# EAGLE design combo_board (EAGLE 9.5.2)
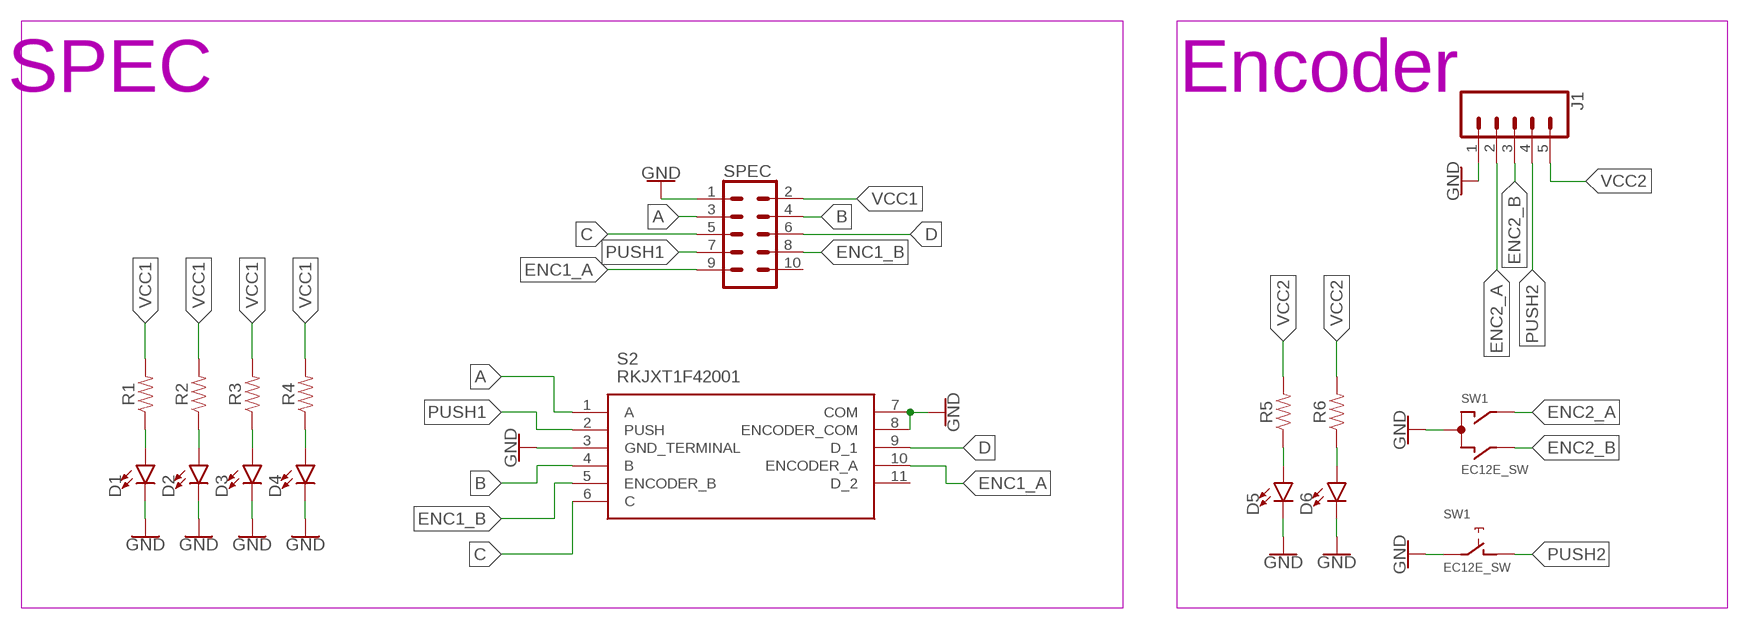
[diagram p0: schematic, sheet 1]

## Parts
D1  LED-3MM-NO_SILK  [LED_3MM-NS]
D2  LED-3MM-NO_SILK  [LED_3MM-NS]
D3  LED-3MM-NO_SILK  [LED_3MM-NS]
D4  LED-3MM-NO_SILK  [LED_3MM-NS]
D5  LED-3MM-NO_SILK  [LED_3MM-NS]
D6  LED-3MM-NO_SILK  [LED_3MM-NS]
J1  CONN_05  [1X05]
R1  RESISTOR1206  [1206]
R2  RESISTOR1206  [1206]
R3  RESISTOR1206  [1206]
R4  RESISTOR1206  [1206]
R5  RESISTOR1206  [1206]
R6  RESISTOR1206  [1206]
S2  RKJXT1F42001  [RKJXT1F42001]
SPEC  CONN_05X2PTH  [2X5]
SW1  EC12E_SW  [ALPS_EC12E_SW]

## Nets
A: S2.1(A) SPEC.3
B: S2.4(B) SPEC.4
C: S2.6(C) SPEC.5
D: S2.9(D_1) SPEC.6
ENC1_A: S2.10(ENCODER_A) SPEC.9
ENC1_B: S2.5(ENCODER_B) SPEC.8
ENC2_A: J1.2 SW1.A
ENC2_B: J1.3 SW1.B
GND: D1.K(C) D2.K(C) D3.K(C) D4.K(C) D5.K(C) D6.K(C) J1.1 S2.3(GND_TERMINAL) S2.7(COM) S2.8(ENCODER_COM) SPEC.1 SW1.C SW1.E
N$1: D1.A R1.1
N$2: D2.A R2.1
N$3: D3.A R3.1
N$4: D4.A R4.1
N$5: D5.A R5.1
N$6: D6.A R6.1
PUSH1: S2.2(PUSH) SPEC.7
PUSH2: J1.4 SW1.D
VCC1: R1.2 R2.2 R3.2 R4.2 SPEC.2
VCC2: J1.5 R5.2 R6.2
Unconnected: S2.11(D_2) SPEC.10 SW1.GND1(G) SW1.GND2(G)

## Notes on the sheet
- SPEC | Encoder

## Library data of the parts
D1-D6 = SparkFun-LED:LED: LED (Generic) Standard schematic elements and footprints for 5mm, 3mm, 1206, and 0603 sized LEDs. Generic LEDs with no color specified.
J1 = SparkFun-Connectors:CONN_05: Multi connection point. Often used as Generic Header-pin footprint for 0.1 inch spaced/style header connections On any of the 0.1 inch spaced packages, you can populate with these: Break Away Headers - Straight <https://www.sparkfun.com/products/116> (PRT-00116) Break Away Male Headers - Right Angle <https://www.sparkfun.com/products/553> (PRT-00553) Female Headers <https://www.sparkfun.com/products/115> (PRT-00115) Break Away Headers - Machine Pin <https://www.sparkfun.com/products/117> (PRT-00117) Break Away Female Headers - Swiss Machine Pin <https://www.sparkfun.com/products/743> (PRT-00743) For SCREWTERMINALS and SPRING TERMINALS visit here: Screw Terimnals on SparkFun.com <https://www.sparkfun.com/search/results?term=Screw+Terminals> (5mm/3.5mm/2.54mm spacing) This device is also useful as a general connection point to wire up your design to another part of your project. Our various solder wires solder well into these plated through hole pads. Hook-Up Wire - Assortment (Stranded, 22 AWG) <https://www.sparkfun.com/products/11375> (PRT-11375) Hook-Up Wire - Assortment (Solid Core, 22 AWG) <https://www.sparkfun.com/products/11367> (PRT-11367) View the entire wire category on our website here <https://www.sparkfun.com/categories/141> Special notes: Molex polarized connector foot print use with SKU : PRT-08231 with associated crimp pins and housings. 1MM SMD Version SKU: PRT-10208
R1-R6 = SparkFun-Resistors:RESISTOR: Generic Resistor Package
S2 = RKJXT1F42001:RKJXT1F42001: Multi-Directional Switches 4 drectnl swtch cntr push w/ an encoder Source: Datasheet <http://www.alps.com/prod/info/E/HTML/MultiControl/Switch/RKJXT/RKJXT1F42001.html>; DESCRIPTION: Multi-Directional Switches 4 drectnl swtch cntr push w/ an encoder; HEIGHT: 17mm; MANUFACTURER_NAME: ALPS; MANUFACTURER_PART_NUMBER: RKJXT1F42001; MOUSER_PART_NUMBER: 688-RKJXT1F42001; MOUSER_PRICE-STOCK: https://www.mouser.com/Search/Refine.aspx?Keyword=688-RKJXT1F42001; RS_PART_NUMBER: 1239636; RS_PRICE-STOCK: http://uk.rs-online.com/web/p/products/1239636
SPEC = SparkFun-Connectors:CONN_05X2: Multi connection point. Often used as Generic Header-pin footprint for 0.1 inch spaced/style header connections For AVR SPI programming port, see special device with nice symbol: "AVR_SPI_PROG_5x2.dev" You can populate with any combo of single row headers, but if you'd like an exact match, check these: 2x5 AVR ICSP Male Header <https://www.sparkfun.com/products/778> (PRT-00778) 2x5 Pin Shrouded Header <https://www.sparkfun.com/products/8506> (PRT-08506) On any of the 0.1 inch spaced packages, you can populate with these: Break Away Headers - Straight <https://www.sparkfun.com/products/116> (PRT-00116) Break Away Male Headers - Right Angle <https://www.sparkfun.com/products/553> (PRT-00553) Female Headers <https://www.sparkfun.com/products/115> (PRT-00115) Break Away Headers - Machine Pin <https://www.sparkfun.com/products/117> (PRT-00117) Break Away Female Headers - Swiss Machine Pin <https://www.sparkfun.com/products/743> (PRT-00743) Special note: the shrouded connector mates well with our 5x2 ribbon cables: 2x5 Pin IDC Ribbon Cable <https://www.sparkfun.com/products/8535> (PRT-08535); PROD_ID: CONN-08499; SF_ID: PRT-0778
SW1 = switch-alps:EC12E_SW: ALPS rotary Encoder EC12E series with switch; MPN: EC12E2424407; OC_FARNELL: 1520813; OC_NEWARK: 74M1068

## Board
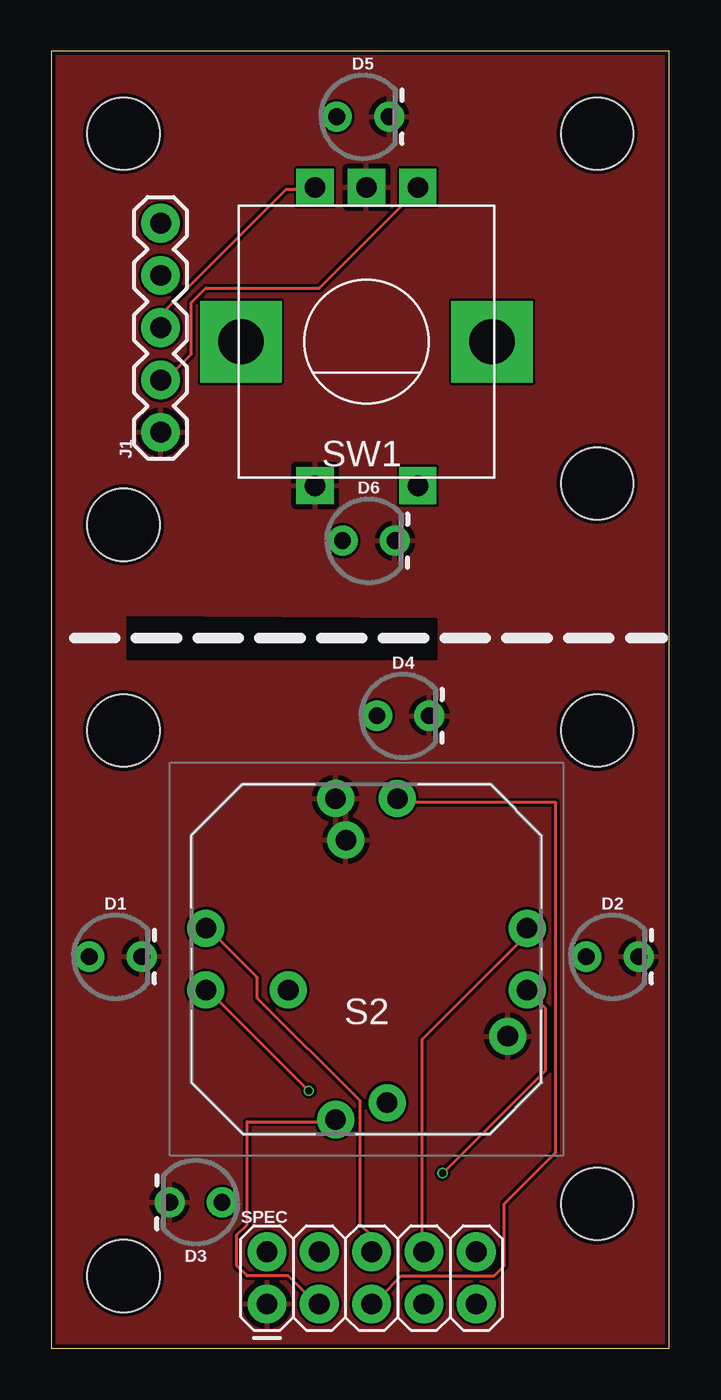
[diagram p1: board, top side]
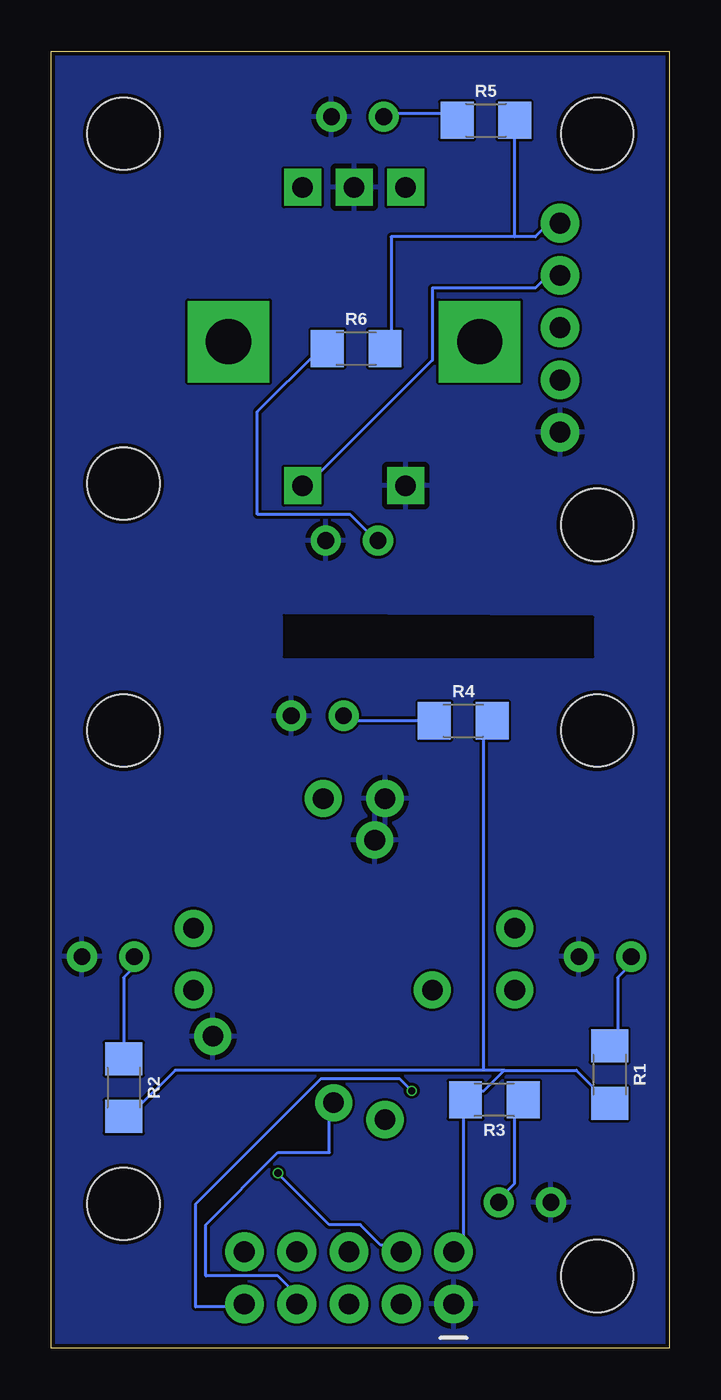
[diagram p2: board, bottom side, seen from below]

Size 30 x 63 mm. Coordinates in mm from the lower left corner, seen from the top.
Outline: 0,0 30,0 30,63 0,63 0,0
Copper layers (1*16): Top 0.035mm / dielectric 1.6mm / Bottom 0.035mm
Design rules "jlcpcb-2layers": minimum track width 5mil, minimum drill 0.3mm, track to track 5mil, track to pad 5mil, pad to pad 5mil, via to via 5mil, smd to smd 5mil, copper to edge 0.2mm, drill to drill 6mil, minimum pad ring 10mil, minimum via ring 3mil, stop-mask expansion 4mil, vias tented up to drill 0mil, thermal gap 10mil
Holes 3.5 mm at 26.5,59 3.5,59 3.5,40 26.5,42 3.5,30 26.5,30 26.5,7 3.5,3.5
tRestrict: area 3.7,33.5 to 18.7,35.5
bRestrict: area 3.7,33.6 to 18.7,35.6

### Footprints (pad centres in the part's own frame; a part is rotated, then mirrored left to right if it is on the bottom)
LED_3MM-NS = drill 0.813: A -1.27,0; K 1.27,0
1X05 = drill 1.016 pad 1.88: 1 0,0; 2 2.54,0; 3 5.08,0; 4 7.62,0; 5 10.16,0
1206 = smd 1.6 x 1.8: 1 -1.4,0; 2 1.4,0
RKJXT1F42001 = drill 1 pad 1.5: 1 -1.5,-7.8; 2 1,-6.98; 3 6.86,-3.75; 4 7.8,-1.5; 5 7.8,1.5; 6 1.5,7.8; 7 -1,5.78; 8 -1.5,7.8; 9 -7.8,1.5; 10 -7.8,-1.5; 11 -3.8,-1.5
2X5 = drill 1.016 pad 1.88: 1 0,0; 2 0,2.54; 3 2.54,0; 4 2.54,2.54; 5 5.08,0; 6 5.08,2.54; 7 7.62,0; 8 7.62,2.54; 9 10.16,0; 10 10.16,2.54
ALPS_EC12E_SW = drill 1 square: A -2.5,-7.5; B 2.5,-7.5; C 0,-7.5; D -2.5,7; E 2.5,7 | drill 2.2 square: GND1 -6.1,0; GND2 6.1,0

### Placement (x,y rotation side)
D1  3.11,19.02 0 top
D2  27.25,19.02 0 top
D3  7.01,7.08 180 top
D4  17.08,30.72 0 top
D5  15.13,59.83 0 top
D6  15.41,39.23 0 top
J1  5.3,44.5 90 top
R1  2.89,13.29 270 bottom
R2  26.49,12.65 270 bottom
R3  8.49,12.06 180 bottom
R4  10,30.48 0 bottom
R5  8.9,59.65 0 bottom
R6  15.2,48.57 0 bottom
S2  15.3,18.9 0 top
SPEC  10.47,2.14 0 top
SW1  15.3,48.9 180 top

### Tracks (layer width: path | path; a pad name or v marks a point on that pad's centre or on a via)
A
  Top 0.152: S2.1 13.5,11 9.5,11 9.5,6 9,5.5 9,4 9.5,3.5 11.5,3.5 13,2 SPEC.3
B  (via drill 0.35)
  Top 0.152: S2.4 24,16.5 24,13.5 v19,8.5
  Bottom 0.152: v19,8.5 16.5,6 15,6 14,5 13.5,5 SPEC.4
C
  Top 0.152: S2.6 17,26.5 24.5,26.5 24.5,9.5 22,7 22,4 21.5,3.5 17,3.5 16,2.5 SPEC.5
D
  Top 0.152: S2.9 7.5,20 8,20 10,18 10,17 15,12 15,6 15.5,5.5 15.5,5 SPEC.6
ENC1_A  (via drill 0.35)
  Top 0.152: v12.5,12.5 8,17 7.5,17 S2.10
  Bottom 0.152: v12.5,12.5 13.1,13.1 16.9,13.1 23,7 23,2 21,2 SPEC.9
ENC1_B
  Top 0.152: S2.5 23,20 18,15 18,5 SPEC.8
ENC2_A
  Top 0.152: SW1.A 17.5,56 13,51.5 7.5,51.5 6.8,50.8 6.8,48.3 5.5,47 J1.2
ENC2_B
  Top 0.152: J1.3 5.3,50.2 11.4,56.3 12.72,56.3 SW1.B
GND
  pour Top: 0.1,66.1 0.1,-0.2 31,-0.2 31,65.3 31.98,66.28
  pour Bottom: 0,66.3 0,0.1 0.4,-0.3 36,-0.3 36,66.3
N$1
  Bottom 0.152: R1.1 2.5,15 2.5,18 1.5,19 D1.A
N$2
  Bottom 0.152: R2.1 26.5,14.5 26.5,18 25.5,19 D2.A
N$3
  Bottom 0.152: R3.1 7.5,12 7.5,8 8,7.5 D3.A
N$4
  Bottom 0.152: R4.1 11.5,30.5 15.5,30.5 D4.A
N$5
  Bottom 0.152: R5.1 10.5,60 13.5,60 D5.A
N$6
  Bottom 0.152: R6.1 17,48.5 20,45.5 20,40.5 15.5,40.5 14.5,39.5 D6.A
PUSH1
  Bottom 0.152: S2.2 16.5,11.5 16.5,9.5 19,9.5 22.5,6 22.5,3.5 19,3.5 18,2.5 SPEC.7
PUSH2
  Bottom 0.152: SW1.D 17.5,42 11.5,48 11.5,51.5 6.5,51.5 6,52 5.5,52 J1.4
VCC1
  Bottom 0.152: R1.2 4.5,13.5 8,13.5 | 8,13.5 9,12.5 9.5,12.5 R3.2 10,12 10,5 SPEC.2 | 8,13.5 9,13.5 | 9,13.5 24,13.5 26,11.5 R2.2 | 9,13.5 9,30 R4.2
VCC2
  Bottom 0.152: 7.5,54 6.5,54 6,54.5 5.5,54.5 J1.5 | 7.5,54 13.5,54 13.5,49 R6.2 | 7.5,54 R5.2